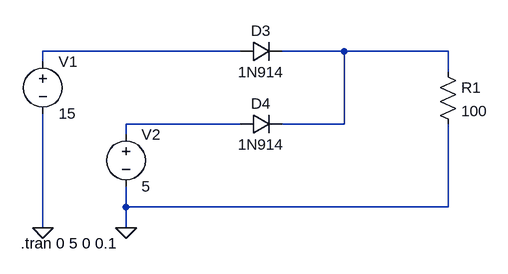
[diagram p0: schematic 15V_5V_Supply_Effects.asc]
15V_5V_Supply_Effects.asc, the LTspice schematic file:
Version 4
SHEET 1 932 680
WIRE 544 16 240 16
WIRE 704 16 608 16
WIRE 864 16 704 16
WIRE 240 32 240 16
WIRE 864 48 864 16
WIRE 544 128 368 128
WIRE 704 128 704 16
WIRE 704 128 608 128
WIRE 368 144 368 128
WIRE 368 256 368 224
WIRE 864 256 864 128
WIRE 864 256 368 256
WIRE 240 288 240 112
WIRE 368 288 368 256
FLAG 368 288 0
FLAG 240 288 0
SYMBOL diode 544 32 R270
WINDOW 0 32 32 VTop 2
WINDOW 3 0 32 VBottom 2
SYMATTR InstName D3
SYMATTR Value 1N914
SYMBOL diode 544 144 R270
WINDOW 0 32 32 VTop 2
WINDOW 3 0 32 VBottom 2
SYMATTR InstName D4
SYMATTR Value 1N914
SYMBOL voltage 240 16 R0
WINDOW 123 0 0 Left 0
WINDOW 39 0 0 Left 0
SYMATTR InstName V1
SYMATTR Value 15
SYMBOL voltage 368 128 R0
WINDOW 123 0 0 Left 0
WINDOW 39 0 0 Left 0
SYMATTR InstName V2
SYMATTR Value 5
SYMBOL res 848 32 R0
SYMATTR InstName R1
SYMATTR Value 100
TEXT 206 312 Left 2 !.tran 0 5 0 0.1

The netlist it stands for:
* 15V_5V_Supply_Effects.asc
D3 N001 N002 1N914
D4 N003 N002 1N914
V1 N001 0 15
V2 N003 0 5
R1 N002 0 100
.model D D
.lib standard.dio
.tran 0 5 0 0.1
.backanno
.end